# Altium schematic sheet SDCard.SchDoc
size A4
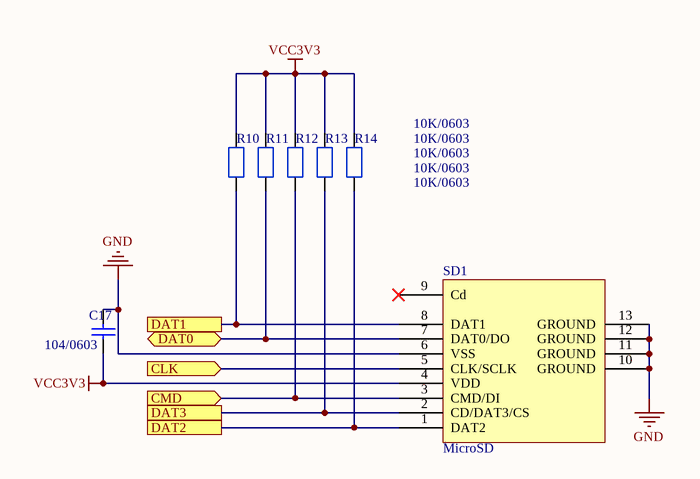
[diagram p0: SDCard.SchDoc]

## Parts
C17  104/0603  [C0603]
R10  10K/0603  [R0603]
R11  10K/0603  [R0603]
R12  10K/0603  [R0603]
R13  10K/0603  [R0603]
R14  10K/0603  [R0603]
SD1  MicroSD  [SD_Card_M]

## Ports
CLK (in), CMD (in), DAT0, DAT1, DAT2, DAT3

## Nets
GND: C17.2 SD1.6(VSS) SD1.10(GROUND) SD1.11(GROUND) SD1.12(GROUND) SD1.13(GROUND)
VCC3V3: C17.1 R10.2 R11.2 R12.2 R13.2 R14.2 SD1.4(VDD)
CLK: SD1.5(CLK/SCLK) ; port CLK
CMD: R12.1 SD1.3(CMD/DI) ; port CMD
DAT0: R11.1 SD1.7(DAT0/DO) ; port DAT0
DAT1: R10.1 SD1.8(DAT1) ; port DAT1
DAT2: R14.1 SD1.1(DAT2) ; port DAT2
DAT3: R13.1 SD1.2(CD/DAT3/CS) ; port DAT3

Not connected (* = marked no-connect by the designer): SD1 9(Cd)*

## Library data of the parts
C17 = CAP: 无极性贴片电容
R10-R14 = RES
SD1 = MicroSD: TF卡槽